# Altium schematic sheet ImageSignalProcessor.SchDoc: Image Signal Processor
size 431 x 279 mm; Date: 9/19/2023; Revision: 1; SheetNumber: 1; SheetTotal: 2; ENG_APP_DATE: --/--/--; DSN_APP_DATE: --/--/--; CHK_APP_DATE: --/--/--
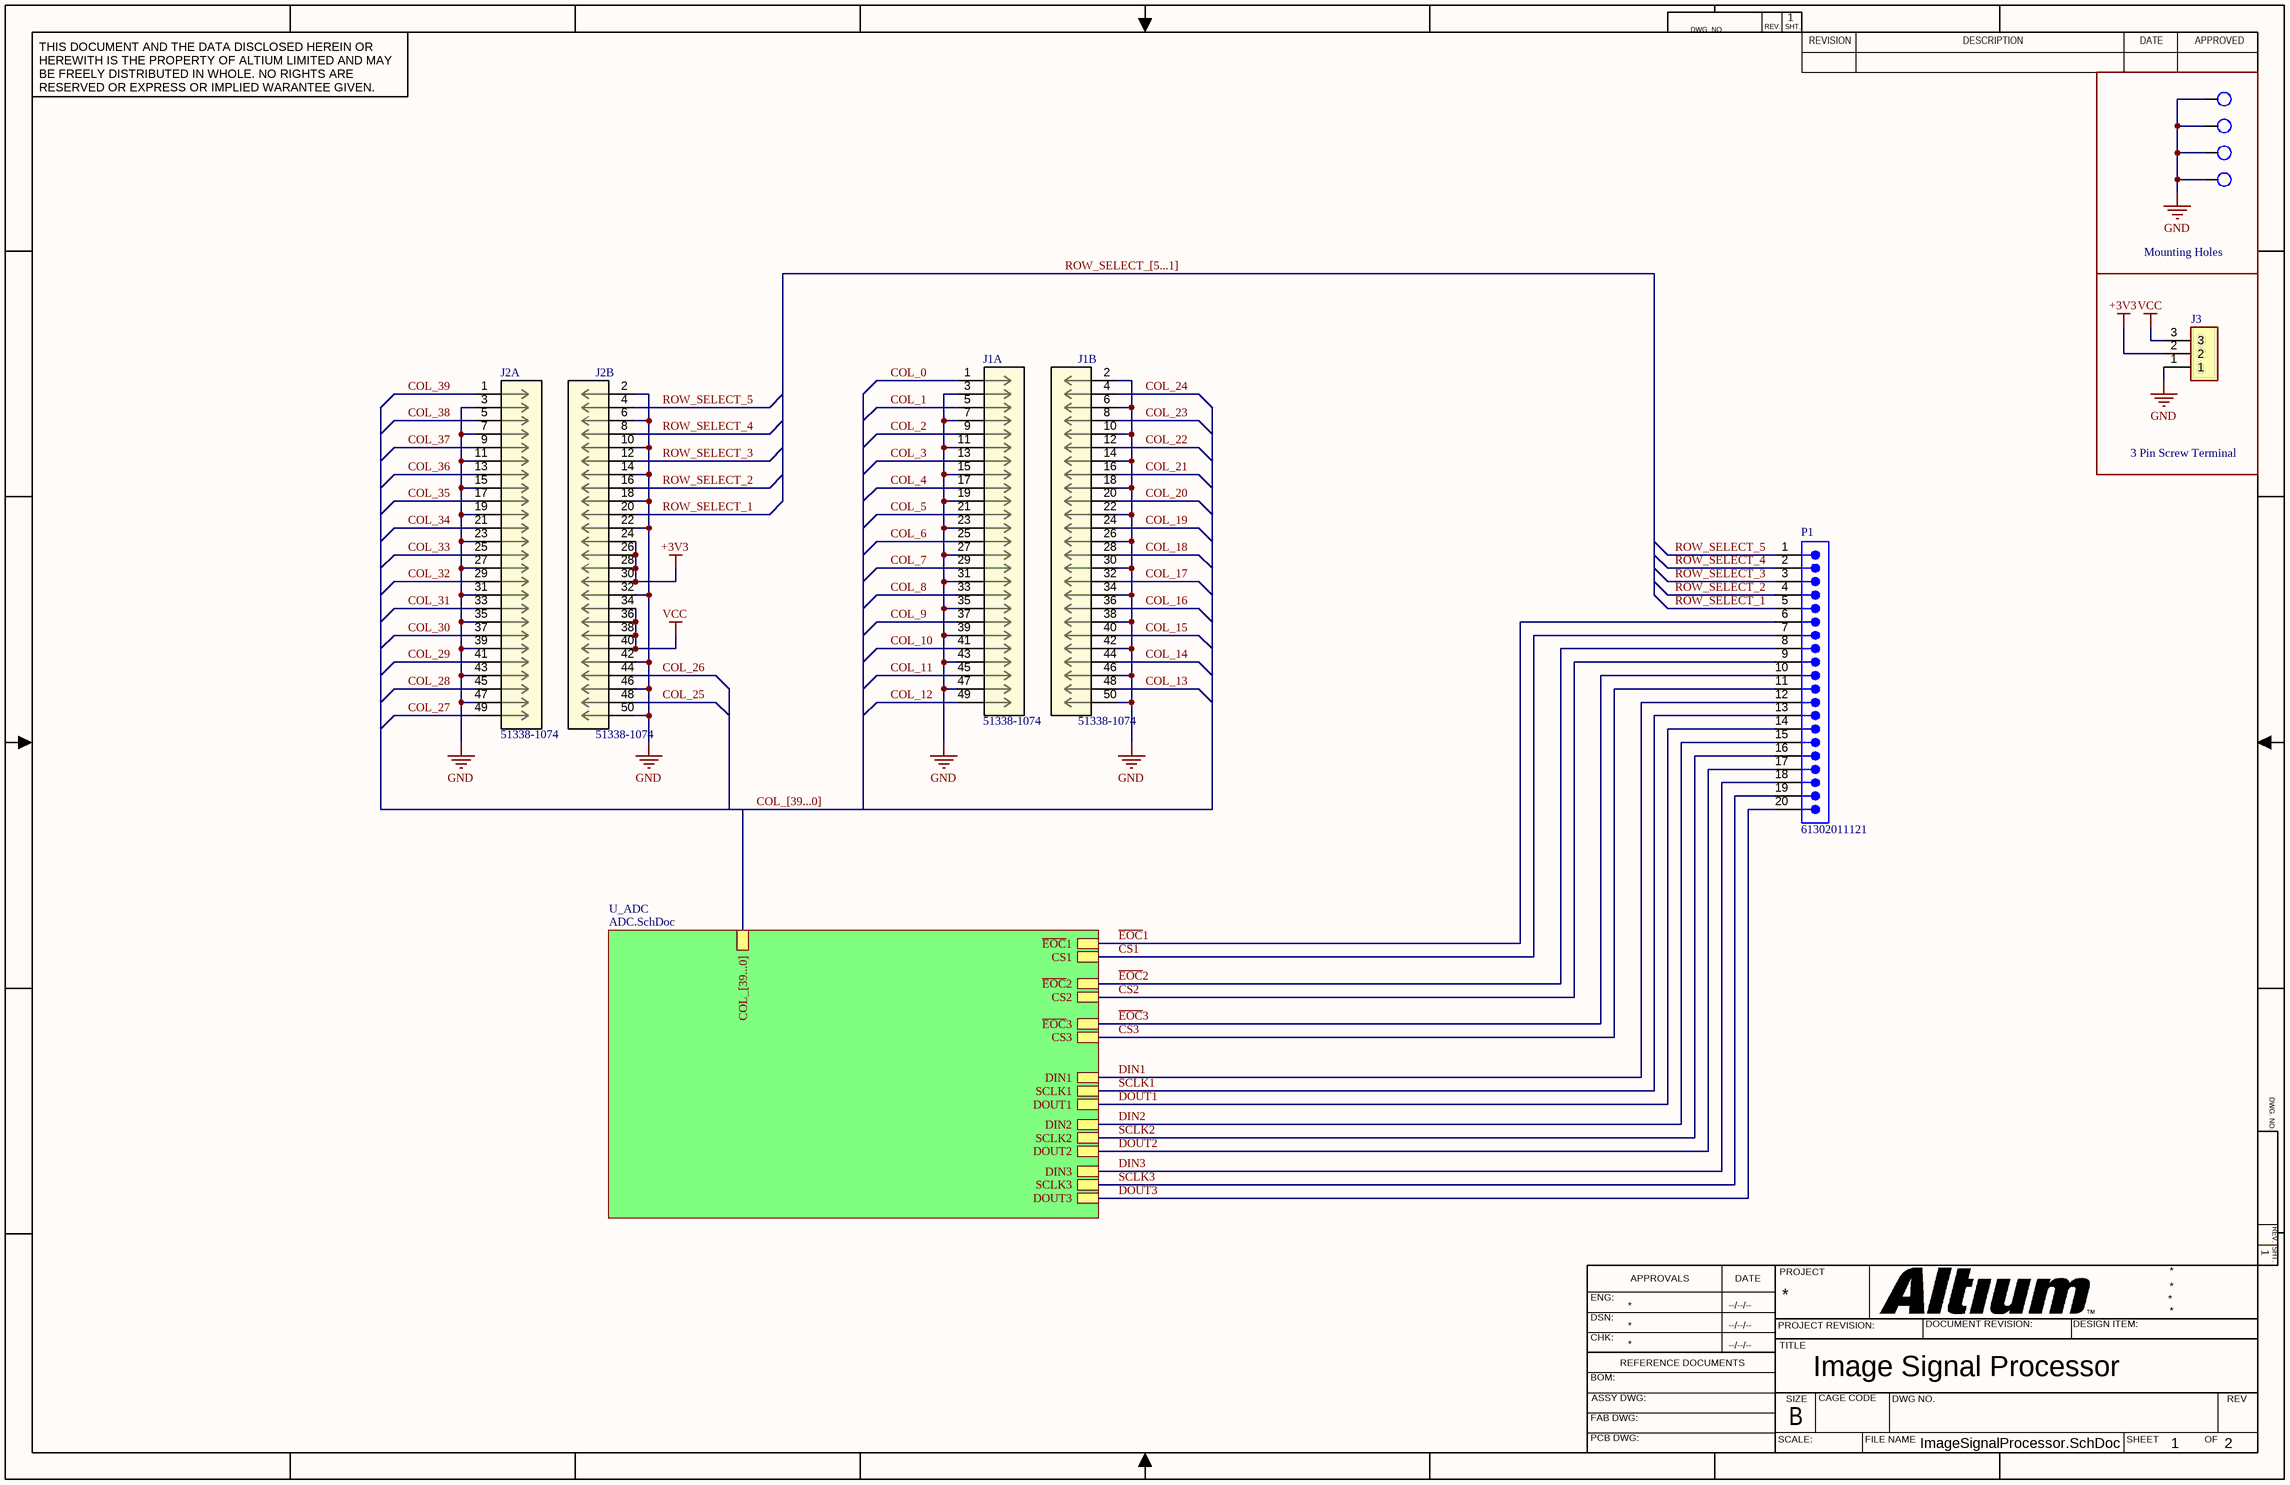
[diagram p0: ImageSignalProcessor.SchDoc]

## Parts
J1  51338-1074  [51338-1074]  (parts A,B of 2)
J2  51338-1074  [51338-1074]  (parts A,B of 2)
J3  3 Pin Screw Terminal  [TE_282837-3]  (value not drawn)
MP1  M3 MOUNTING HOLE  [M3 MOUNTING HOLE]  (value not drawn)
MP2  M3 MOUNTING HOLE  [M3 MOUNTING HOLE]  (value not drawn)
MP3  M3 MOUNTING HOLE  [M3 MOUNTING HOLE]  (value not drawn)
MP4  M3 MOUNTING HOLE  [M3 MOUNTING HOLE]  (value not drawn)
P1  61302011121  [61302011121]

## Blocks framed on the sheet
Mounting Holes: MP1-MP4
3 Pin Screw Terminal: J3

## Sub-sheets
U_ADC = ADC.SchDoc: COL_[39...0], ~{EOC}1, ~{EOC}2, ~{EOC}3, CS1, CS2, CS3, DIN1, SCLK1, DOUT1, DIN2, SCLK2, DOUT2, DIN3, SCLK3, DOUT3

## Nets
+3V3: J2.24 J2.26 J2.28 J2.30 J3.2
GND: J1.2 J1.3 J1.6 J1.7 J1.10 J1.11 J1.14 J1.15 J1.18 J1.19 J1.22 J1.23 J1.26 J1.27 J1.30 J1.31 J1.34 J1.35 J1.38 J1.39 J1.42 J1.43 J1.46 J1.47 J1.50 J2.2 J2.3 J2.6 J2.7 J2.10 J2.11 J2.14 J2.15 J2.18 J2.19 J2.22 J2.23 J2.27 J2.31 J2.32 J2.35 J2.39 J2.42 J2.43 J2.46 J2.47 J2.50 J3.1 MP1.1 MP2.1 MP3.1 MP4.1
VCC: J2.34 J2.36 J2.38 J2.40 J3.3
~{EOC}1: P1.6 ; sheet U_ADC/~{EOC}1
~{EOC}2: P1.8 ; sheet U_ADC/~{EOC}2
~{EOC}3: P1.10 ; sheet U_ADC/~{EOC}3
COL_0: J1.1
COL_1: J1.5
COL_2: J1.9
COL_3: J1.13
COL_4: J1.17
COL_5: J1.21
COL_6: J1.25
COL_7: J1.29
COL_8: J1.33
COL_9: J1.37
COL_10: J1.41
COL_11: J1.45
COL_12: J1.49
COL_13: J1.48
COL_14: J1.44
COL_15: J1.40
COL_16: J1.36
COL_17: J1.32
COL_18: J1.28
COL_19: J1.24
COL_20: J1.20
COL_21: J1.16
COL_22: J1.12
COL_23: J1.8
COL_24: J1.4
COL_25: J2.48
COL_26: J2.44
COL_27: J2.49
COL_28: J2.45
COL_29: J2.41
COL_30: J2.37
COL_31: J2.33
COL_32: J2.29
COL_33: J2.25
COL_34: J2.21
COL_35: J2.17
COL_36: J2.13
COL_37: J2.9
COL_38: J2.5
COL_39: J2.1
CS1: P1.7 ; sheet U_ADC/CS1
CS2: P1.9 ; sheet U_ADC/CS2
CS3: P1.11 ; sheet U_ADC/CS3
DIN1: P1.12 ; sheet U_ADC/DIN1
DIN2: P1.15 ; sheet U_ADC/DIN2
DIN3: P1.18 ; sheet U_ADC/DIN3
DOUT1: P1.14 ; sheet U_ADC/DOUT1
DOUT2: P1.17 ; sheet U_ADC/DOUT2
DOUT3: P1.20 ; sheet U_ADC/DOUT3
ROW_SELECT_1: J2.20 P1.5
ROW_SELECT_2: J2.16 P1.4
ROW_SELECT_3: J2.12 P1.3
ROW_SELECT_4: J2.8 P1.2
ROW_SELECT_5: J2.4 P1.1
SCLK1: P1.13 ; sheet U_ADC/SCLK1
SCLK2: P1.16 ; sheet U_ADC/SCLK2
SCLK3: P1.19 ; sheet U_ADC/SCLK3

## Buses and harness runs
bus COL_[39...0] = sheet U_ADC/COL_[39...0]
bus ROW_SELECT_[5...1]

## Notes on the sheet
- DWG. NO.
- REV.
- SHT.
- THIS DOCUMENT AND THE DATA DISCLOSED HEREIN OR HEREWITH IS THE PROPERTY OF ALTIUM LIMITED AND MAY BE FREELY DISTRIBUTED IN WHOLE. NO RIGHTS ARE RESERVED OR EXPRESS OR IMPLIED WARANTEE GIVEN.
- REVISION
- DESCRIPTION
- DATE
- APPROVED
- ENG:
- APPROVALS
- PROJECT
- DSN:
- CHK:
- REFERENCE DOCUMENTS
- PROJECT REVISION:
- TITLE
- DOCUMENT REVISION:
- DESIGN ITEM:
- BOM:
- FAB DWG:
- PCB DWG:
- ASSY DWG:
- SCALE:
- SIZE
- B
- CAGE CODE
- FILE NAME
- DWG NO.
- SHEET
- OF
- REV

## Library data of the parts
J1 J2 = 51338-1074: Board Connector, 100 Contact(s), 2 Row(s), Female, Straight, 0.016 inch Pitch, Surface Mount Terminal, Locking, Black Insulator, Receptacle; Manufacturer: Molex; Option: General Purpose; Filter Feature: No; Mating Information: MULTIPLE MATING PARTS AVAILABLE; Number of Rows Loaded: 2; Number of Contacts: 100; Board Mounting Option: FITTING NAIL; Contact Pattern: RECTANGULAR; Contact Resistance: 40mR; Insulation Resistance: 100MR; Number Of Connectors: 1; Rated Current (Signal): 300mA; Body Breadth: 0.134inch; Body Depth: 0.053inch; Body Length: 0.909inch; Mating Contact Row Spacing: 0.043inch; PCB Contact Row Spacing: 1.4986mm; Reference Standard: UL; Reliability: COMMERCIAL; Supplier: Mouser; Supplier Part Number: 538-51338-1074; Manufacturer Part Number: 51338-1074; RoHS: Yes; Category: Headers and Wire Housings; Stock: 1434; Pricing: 1=3.42, 10=3.08, 50=3.08, 100=2.57, 500=2.56, 1000=2.27, 10000=2.27 (USD); Mounting Technology: Board; Contact Finish - Mating: GOLD; Contact Finish - Termination: GOLD; Insulation Color: Black; Insulation Material: Polymer; Min Operating Temperature: -25°C; Max Operating Temperature: 85°C; Connector Type: BOARD CONNECTOR; JESD-609 Code: e4; Contact Gender: Female; Mixed Contacts: No; Mounting Style: STRAIGHT; Termination: SMD/SMT; Body/Shell Style: RECEPTACLE; Number Of PCB Rows: 2; PCB Contact Pattern: RECTANGULAR; Terminal Pitch: 0.4mm; Mating Contact Pitch: 0.016inch; Mounting Option 1: LOCKING; Flammability Rating: UL94 V-0; DIN Conformance: No; IEC Conformance: No; MIL Conformance: No; Reach SVHC Compliant: Yes; RoHS Compliant: Yes; ComponentLink1URL: https://datasheet.ciiva.com:443/pdfs/VipMasterIC/IC/MOLE/MOLE-S-A0003536377/MOLE-S-A0003536377-1.pdf?src-supplier=IHS+Markit; ComponentLink1Description: https://datasheet.ciiva.com:443/pdfs/VipMasterIC/IC/MOLE/MOLE-S-A0003536377/MOLE-S-A0003536377-1.pdf?src-supplier=IHS+Markit; ComponentLink2URL: https://datasheet.ciiva.com/5129/0513381074-pcb-receptacles-149270-5129725.pdf?src-supplier=Mouser; ComponentLink2Description: https://datasheet.ciiva.com/5129/0513381074-pcb-receptacles-149270-5129725.pdf?src-supplier=Mouser; ComponentLink3URL: https://datasheet.ciiva.com/46409/1597556-46409754.pdf?src-supplier=Element14; ComponentLink3Description: https://datasheet.ciiva.com/46409/1597556-46409754.pdf?src-supplier=Element14
J3 = 282837-3: Modular Terminal Block, 13.5A, 1.5mm2, 1 Row(s), 1 Deck(s); Manufacturer: TE Connectivity; Manufacturer Series: 282837; Number of Decks: 1; Number of Ways: 3; Voltage Rating: 300V; Wire/Cable Gauge: 15AWG; Safety Approval: UL; Supplier: Future Electronics; Supplier Part Number: 3579695; Manufacturer Part Number: 282837-3; RoHS: Yes; Category: Terminal Blocks; Stock: 18400; Pricing: 1=0.68, 50=0.66, 200=0.625, 500=0.61, 2000=0.56 (USD); Mounting Technology: Board; Terminal and Terminal Block Type: MODULAR TERMINAL BLOCK; Fastening Method: SCREW; Number of Rows: 1; Current Rating: 13.5A; Wire Cross Section: 1.5mm2; RoHS Compliant: Yes; Reach SVHC Compliant: No; ComponentLink1URL: https://www.te.com:443/usa-en/product-282837-3.html?src-supplier=IHS+Markit; ComponentLink1Description: https://www.te.com:443/usa-en/product-282837-3.html?src-supplier=IHS+Markit; ComponentLink2URL: https://datasheet.ciiva.com/16305/eng-cs-1308389-eurostyle-terminal-blocks-0607-16305250.pdf?src-supplier=Future+Electronics; ComponentLink2Description: https://datasheet.ciiva.com/16305/eng-cs-1308389-eurostyle-terminal-blocks-0607-16305250.pdf?src-supplier=Future+Electronics; ComponentLink3URL: https://datasheet.ciiva.com/11758/0900766b80e7dc97-11758673.pdf?src-supplier=Rs; ComponentLink3Description: https://datasheet.ciiva.com/11758/0900766b80e7dc97-11758673.pdf?src-supplier=Rs; ComponentLink4URL: https://datasheet.ciiva.com/30149/eng-cs-1308389-eurostyle-terminal-blocks-0607-30149775.pdf?src-supplier=Onlinecomponents.com; ComponentLink4Description: https://datasheet.ciiva.com/30149/eng-cs-1308389-eurostyle-terminal-blocks-0607-30149775.pdf?src-supplier=Onlinecomponents.com; ComponentLink5URL: https://datasheet.ciiva.com/3141/eng-cs-1308389-eurostyle-terminal-blocks-0607-3141580.pdf?src-supplier=Avnet; ComponentLink5Description: https://datasheet.ciiva.com/3141/eng-cs-1308389-eurostyle-terminal-blocks-0607-3141580.pdf?src-supplier=Avnet; ComponentLink6URL: https://datasheet.ciiva.com/7978/1650926-7978570.pdf?src-supplier=Element14; ComponentLink6Description: https://datasheet.ciiva.com/7978/1650926-7978570.pdf?src-supplier=Element14; ComponentLink7URL: https://datasheet.ciiva.com/823/eng-cd-282837-g3-823447.pdf?src-supplier=Digi-Key; ComponentLink7Description: https://datasheet.ciiva.com/823/eng-cd-282837-g3-823447.pdf?src-supplier=Digi-Key; ComponentLink8URL: https://datasheet.ciiva.com/18620/eng-cd-282837-g3-18620919.pdf?src-supplier=Digi-Key; ComponentLink8Description: https://datasheet.ciiva.com/18620/eng-cd-282837-g3-18620919.pdf?src-supplier=Digi-Key
P1 = CMP-1502-01102-2: NexarPartId: 32855554; Number of Contacts: 20; Contact Resistance: 20mΩ; Pitch: 2.54mm; Gender: Male; Operating Supply Voltage: 250V; Connector Type: Male Pin; Current Rating: 3A; Packaging: Bulk; RoHS: Compliant; Contact Material: Copper; Contact Mating Length: 5.9944mm; Number of Positions: 20; Orientation: Vertical; Termination: Solder; Number of Pins: 20; Color: Black; REACH SVHC: Unknown; Mount: Through Hole; Contact Plating: Gold; Number of Rows: 1; Lead Pitch: 2.54mm